# EasyEDA Pro project ProPrj_Maggy 4.1_2025-02-07.epro, board PCB1
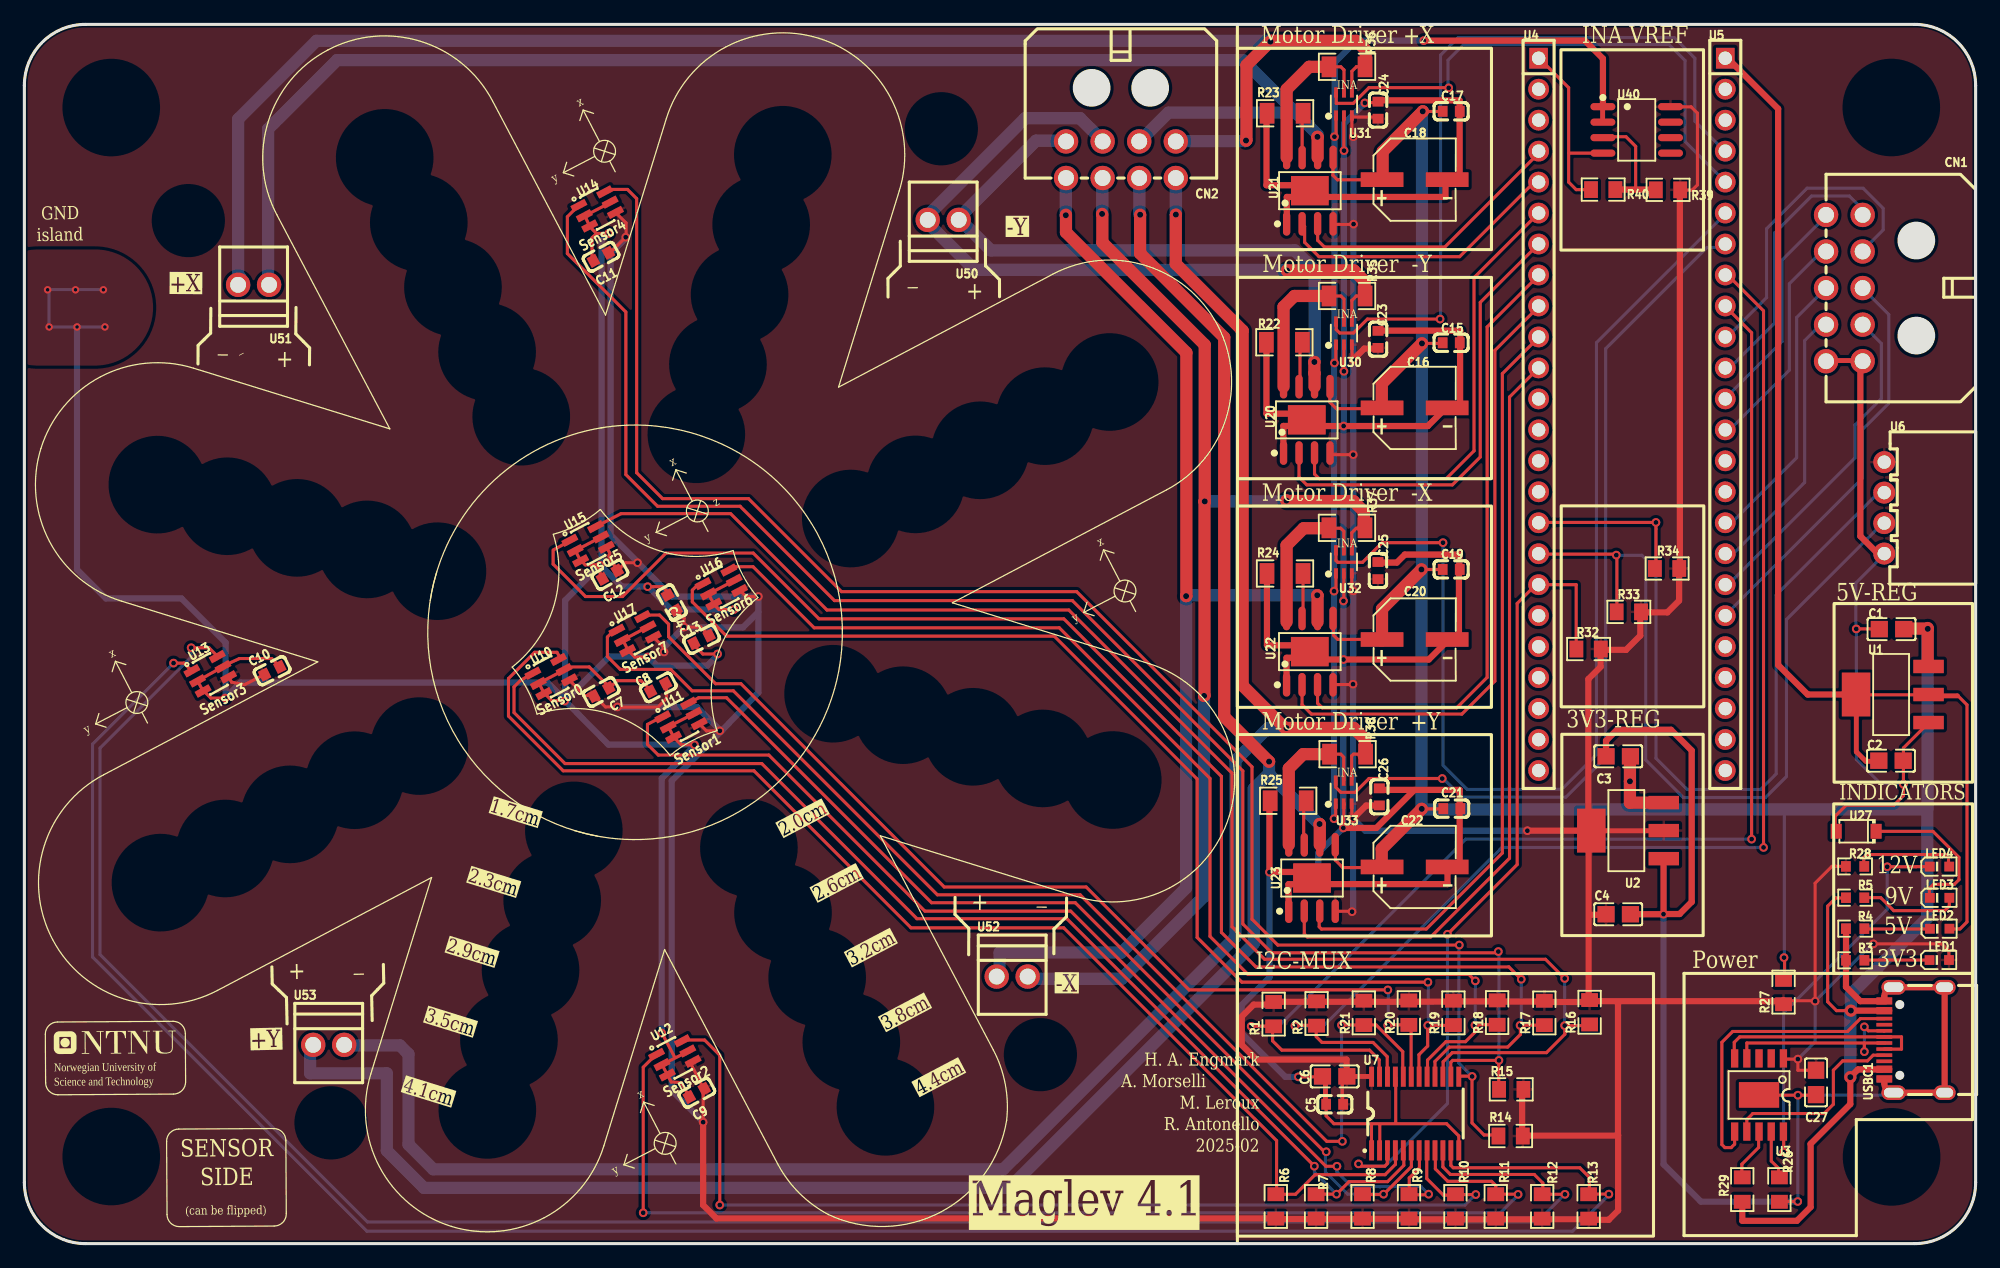
[diagram p1: board, top side]
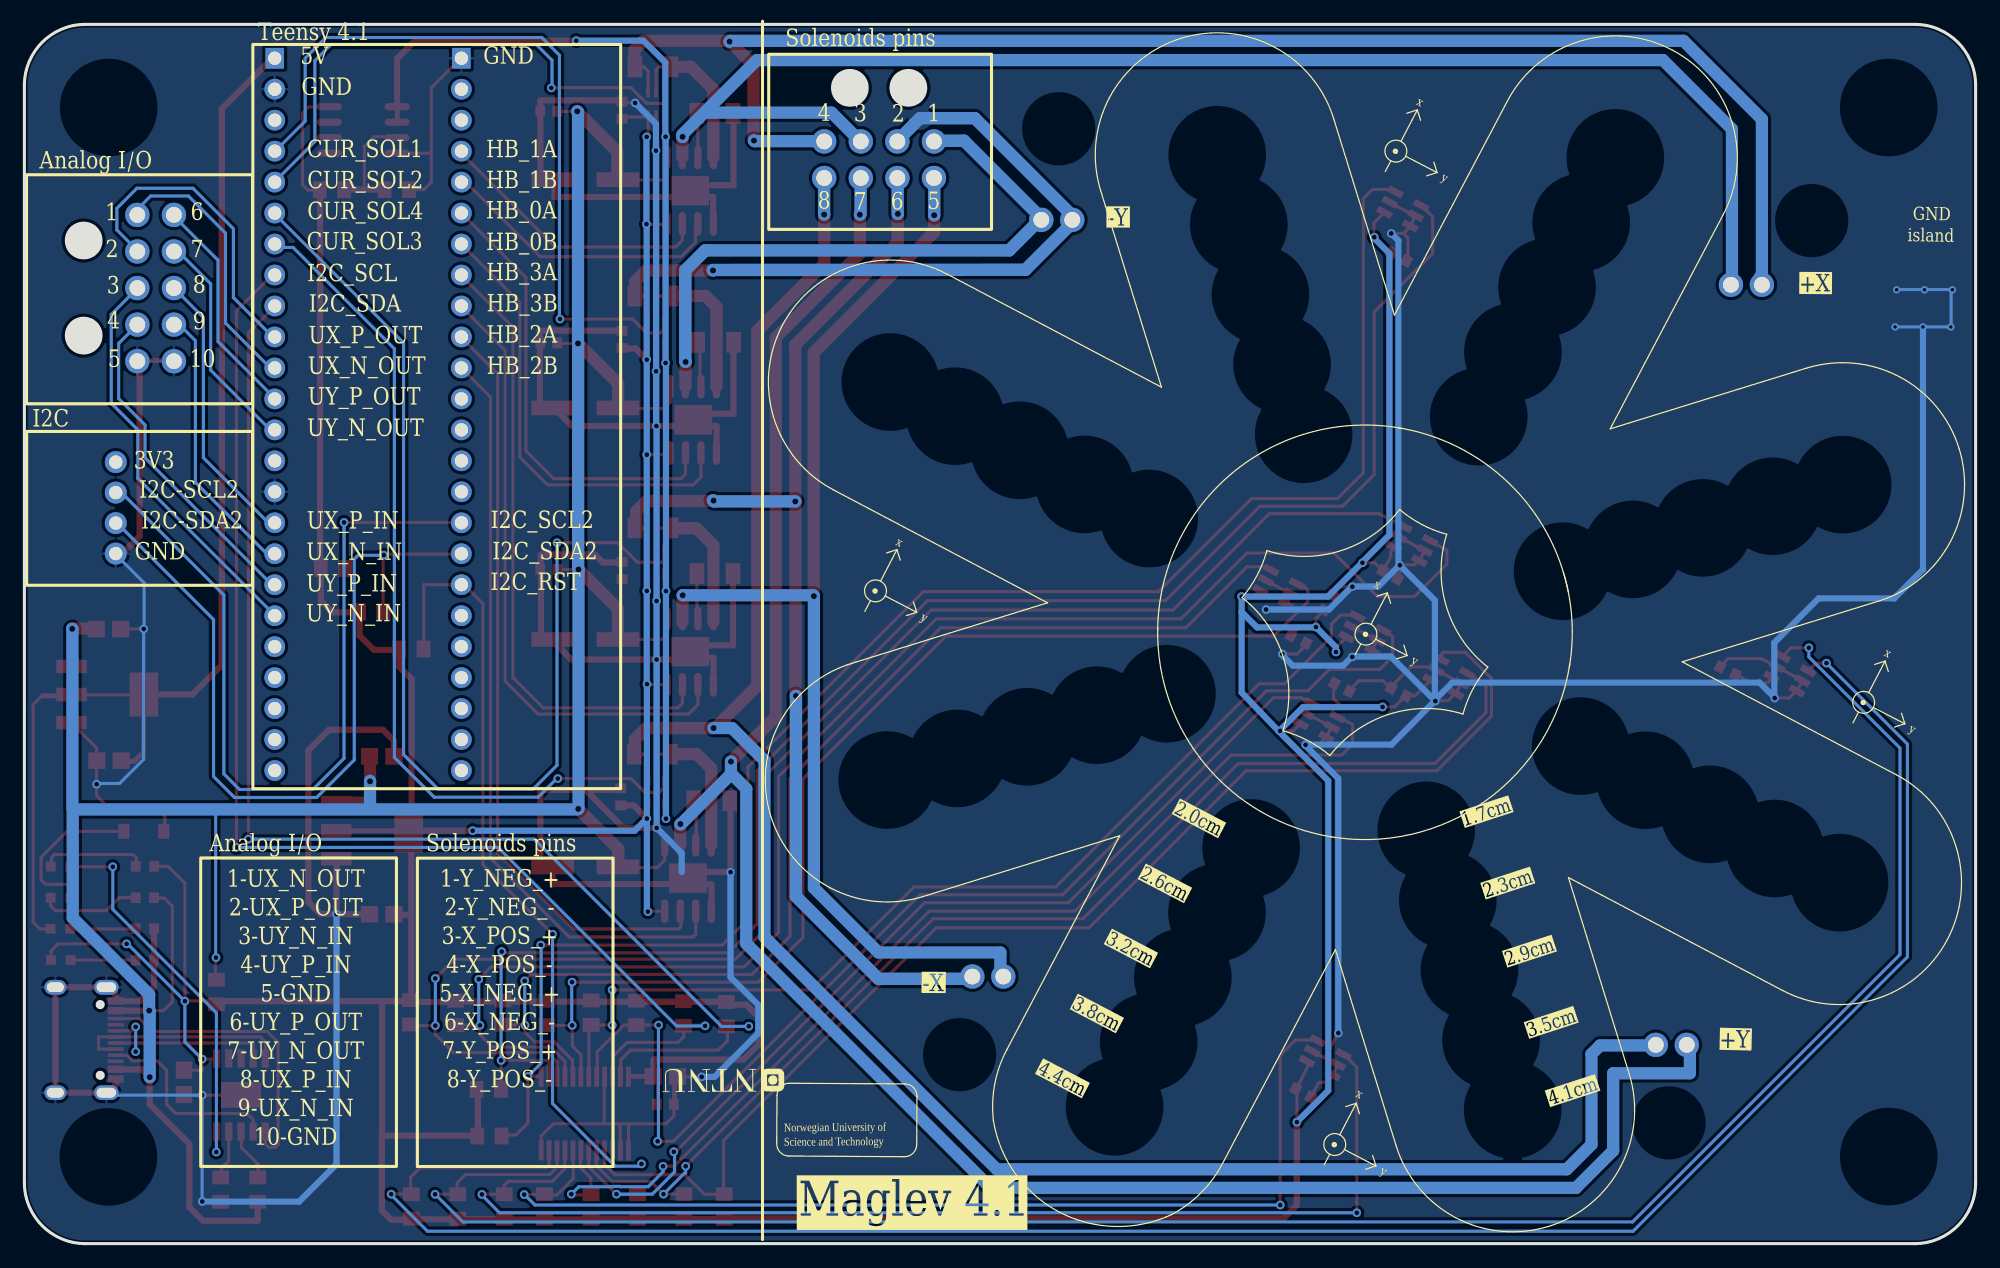
[diagram p2: board, bottom side, seen from below]

Outline 160 x 100 mm; copper layers: Top Layer, Bottom Layer. Coordinates in mm from the lower left corner of the outline.
Outline path: 0,95 0,5 arc(1.46,1.46) 5,0 155,0 arc(158.54,1.46) 160,5 160,95 arc(158.54,98.54) 155,100 5,100 arc(1.46,98.54) 0,95
Stack: Top Layer 0.035mm / Dielectric1 1.51mm FR4 er 4.5 / Bottom Layer 0.035mm

## Design rules (mm)
template: Custom Config
spacing copperThickness1oz (default): track to track 0.102, other pairs 0.152 to 0.3
spacing copperThickness2oz: track to track 0.203, other pairs 0.152 to 0.3
track width copperThickness1oz (default): min 0.127, default 0.254, max 2.54
track width copperThickness2oz: min 0.203, default 0.254, max 2.54
track width VBUS: min 0.127, default 1, max 2.54
differential pair differentialPair (default): width min 0.127, default 0.254, max 2.54; gap min 0.152, default 0.152
via viaSize (default): diameter min 0.5, default 0.61, max 10; hole min 0.3, default 0.305, max 6.3

## Placement (name value [footprint] x y rotation side)
C1  10uF  [C0805]  153.1 50.4 180 top
C2  10uF  [C0805]  153.06 39.61 0 top
C3  10uF  [C0805]  130.7 39.97 180 top
C4  10uF  [C0805]  130.7 27.01 0 top
C5  100nF  [C0603]  107.44 11.43 180 top
C6  1uF  [C0805]  107.44 13.72 0 top
C7  100nF  [C0603]  47.31 45.24 28.3 top
C8  100nF  [C0603]  51.97 45.62 207.8 top
C9  100nF  [C0603]  55.13 12.36 208.7 top
C10  100nF  [C0603]  20.32 46.99 26.6 top
C11  100nF  [C0603]  47.28 80.94 208.6 top
C12  100nF  [C0603]  48.01 54.86 209.1 top
C13  100nF  [C0603]  55.52 49.56 206.6 top
C14  100nF  [C0603]  53.09 52.58 118.9 top
C15  100nF  [C0603]  117 73.88 0 top
C16  100uF  [CAP-SMD_BD6.3-L6.6-W6.6-LS7.2-FD]  114 68.54 0 top
C17  100nF  [C0603]  117 92.87 0 top
C18  100uF  [CAP-SMD_BD6.3-L6.6-W6.6-LS7.2-FD]  114 87.27 0 top
C19  100nF  [C0603]  117 55.3 0 top
C20  100uF  [CAP-SMD_BD6.3-L6.6-W6.6-LS7.2-FD]  114 49.55 0 top
C21  100nF  [C0603]  117.05 35.67 0 top
C22  100uF  [CAP-SMD_BD6.3-L6.6-W6.6-LS7.2-FD]  114 30.9 0 top
C23  100nF  [C0603]  111 74.17 270 top
C24  100nF  [C0603]  111 92.96 270 top
C25  100nF  [C0603]  110.99 55.2 270 top
C26  100nF  [C0603]  111.1 36.64 270 top
C27  1uF  [C0805]  146.91 13.22 270 top
CN1  430451000  [CONN-TH_43045-1000]  149.24 78.37 90 top
CN2  0430450800  [CONN-TH_0430450800]  89.92 88.9 180 top
LED1  XL-1608SYGC-06  [LED0603-RD_GREEN]  157.02 23.26 0 top
LED2  XL-1608SYGC-06  [LED0603-RD_GREEN]  157.05 25.83 0 top
LED3  XL-1608SYGC-06  [LED0603-RD_GREEN]  157.04 28.36 0 top
LED4  XL-1608SYGC-06  [LED0603-RD_GREEN]  157.04 30.92 0 top
R1  1k2  [R0805]  102.44 18.82 90 top
R2  1k2  [R0805]  105.96 18.87 90 top
R3  56  [R0603]  150.13 23.24 0 top
R4  120  [R0603]  150.12 25.83 0 top
R5  200  [R0603]  150.12 28.37 180 top
R6  1k2  [R0805]  102.62 3.05 270 top
R7  1k2  [R0805]  105.92 3.05 270 top
R8  1k2  [R0805]  109.73 3.05 270 top
R9  1k2  [R0805]  113.54 3.05 270 top
R10  1k2  [R0805]  117.35 3.05 270 top
R11  1k2  [R0805]  120.65 3.05 270 top
R12  1k2  [R0805]  124.46 3.05 270 top
R13  1k2  [R0805]  128.27 3.05 270 top
R14  1k2  [R0805]  121.87 8.83 0 top
R15  1k2  [R0805]  121.92 12.65 0 top
R16  1k2  [R0805]  128.35 18.98 90 top
R17  1k2  [R0805]  124.63 18.92 90 top
R18  1k2  [R0805]  120.76 18.95 90 top
R19  1k2  [R0805]  117.18 18.92 90 top
R20  1k2  [R0805]  113.52 18.94 90 top
R21  1k2  [R0805]  109.83 18.92 90 top
R22  0.3  [R1206]  103.32 73.93 0 top
R23  0.3  [R1206]  103.38 92.71 0 top
R24  0.3  [R1206]  103.37 54.96 0 top
R25  0.3  [R1206]  103.63 36.32 0 top
R26  24k  [R0805]  143.91 4.43 270 top
R27  1k  [R0805]  144.25 20.63 90 top
R28  56  [R0603]  150.12 30.94 180 top
R29  10k  [R0805]  140.86 4.43 270 top
R32  1k2  [R0805]  128.26 48.77 180 top
R33  1k2  [R0805]  131.57 51.82 180 top
R34  1k2  [R0805]  134.7 55.37 180 top
R35  15mΩ  [R1206]  108.46 77.72 0 top
R36  15mΩ  [R1206]  108.46 96.52 0 top
R37  15mΩ  [R1206]  108.45 58.71 0 top
R38  15mΩ  [R1206]  108.5 40.14 0 top
R39  10k  [R0805]  134.78 86.43 0 top
R40  10k  [R0805]  129.46 86.45 0 top
U1  LM1117S-5.0  [SOT-223-3_L6.5-W3.4-P2.30-LS7.0-BR]  153.17 45.04 0 top
U2  LM1117S-3.3  [SOT-223-3_L6.5-W3.4-P2.30-LS7.0-BR]  131.46 33.87 0 top
U3  CH224K  [ESSOP-10_L4.9-W3.9-P1.0-LS6.0-TL-EP]  142.24 12.19 180 top
U4  X6511FV-24-C85D32  [HDR-TH_24P-P2.54-V-F]  124.17 68.01 270 top
U5  X6511FV-24-C85D32  [HDR-TH_24P-P2.54-V-F]  139.47 68.01 270 top
U6  XH-4AW米色  [CONN-TH_XH2.54-4AW]  152.51 60.35 270 top
U7  TCA9548APWR  [TSSOP-24_L7.8-W4.4-P0.65-LS6.4-BL]  114.05 10.67 0 top
U10  TLV493DA1B6HTSA2  [SOP-6_L3.0-W1.5-P0.95-LS2.5-BR]  43.2 46.51 208.1 top
U11  TLV493DA1B6HTSA2  [SOP-6_L3.0-W1.5-P0.95-LS2.5-BR]  53.85 42.93 207.8 top
U12  TLV493DA1B6HTSA2  [SOP-6_L3.0-W1.5-P0.95-LS2.5-BR]  53.34 15.24 207.8 top
U13  TLV493DA1B6HTSA2  [SOP-6_L3.0-W1.5-P0.95-LS2.5-BR]  15.24 46.74 209.1 top
U14  TLV493DA1B6HTSA2  [SOP-6_L3.0-W1.5-P0.95-LS2.5-BR#2]  46.97 84.86 207.8 top
U15  TLV493DA1B6HTSA2  [SOP-6_L3.0-W1.5-P0.95-LS2.5-BR]  46.23 57.4 207.8 top
U16  TLV493DA1B6HTSA2  [SOP-6_L3.0-W1.5-P0.95-LS2.5-BR]  57.15 53.85 207.8 top
U17  TLV493DA1B6HTSA2  [SOP-6_L3.0-W1.5-P0.95-LS2.5-BR#2]  50.08 50.03 207.8 top
U20  A4950ELJTR-T  [SOIC-8_L4.9-W3.9-P1.27-LS6.0-BL-EP]  105.16 67.56 0 top
U21  A4950ELJTR-T  [SOIC-8_L4.9-W3.9-P1.27-LS6.0-BL-EP]  105.41 86.36 0 top
U22  A4950ELJTR-T  [SOIC-8_L4.9-W3.9-P1.27-LS6.0-BL-EP]  105.4 48.55 0 top
U23  A4950ELJTR-T  [SOIC-8_L4.9-W3.9-P1.27-LS6.0-BL-EP]  105.59 29.99 0 top
U27  BZT52C6V2  [SOD-123_L2.7-W1.6-LS3.7-RD]  150.21 33.82 180 top
U30  INA214AIDCKR  [SC-70-6_L2.2-W1.3-P0.65-LS2.2-BR]  108.2 74.68 270 top
U31  INA214AIDCKR  [SC-70-6_L2.2-W1.3-P0.65-LS2.2-BR]  108.2 93.47 270 top
U32  INA214AIDCKR  [SC-70-6_L2.2-W1.3-P0.65-LS2.2-BR]  108.2 55.92 270 top
U33  INA214AIDCKR  [SC-70-6_L2.2-W1.3-P0.65-LS2.2-BR]  108.18 37.03 270 top
U40  TLV2372IDR  [SOIC-8_L4.9-W3.9-P1.27-LS6.0-BL]  132.21 91.35 270 top
U50  XY308-2.54-2P  [CONN-TH_XY308-2.54-2P]  75.34 83.97 180 top
U51  XY308-2.54-2P  [CONN-TH_XY308-2.54-2P]  18.8 78.64 180 top
U52  XY308-2.54-2P  [CONN-TH_XY308-2.54-2P]  81 21.9 0 top
U53  XY308-2.54-2P  [CONN-TH_XY308-2.54-2P]  24.95 16.3 0 top
USBC1  TYPE-C-31-M-12  [USB-C_SMD-TYPE-C-31-M-12]  154.99 16.7 90 top

## Footprints (pads in the part's own frame, mm; a bottom-side part is the same pattern mirrored in y, then rotated)
C0603
  rect 0.8x0.9 smd: 1(-0.7,0) 2(0.7,0)
C0805
  rect 1.41x1.35 smd: 1(-1,0) 2(1,0)
CAP-SMD_BD6.3-L6.6-W6.6-LS7.2-FD
  rect 3.5x1.2 smd: 1(-2.67,0) 2(2.67,0)
CONN-TH_43045-1000
  round 2 hole 1.3: 1(6.001,-1.5) 2(3.001,-1.5) 3(0.002,-1.5) 4(-2.998,-1.5) 5(-5.998,-1.5) 6(6.001,1.5) 7(3.001,1.5) 8(0.002,1.5) 9(-2.998,1.5) 10(-6.001,1.5)
CONN-TH_0430450800
  round 2 hole 1.3: 1(4.5,-1.5) 2(1.5,-1.5) 3(-1.5,-1.5) 4(-4.5,-1.5) 5(4.5,1.5) 6(1.5,1.5) 7(-1.5,1.5) 8(-4.5,1.5)
CONN-TH_XH2.54-4AW
  round 1.8 hole 1.1: 1(-3.751,0) 2(-1.248,0) 3(1.251,0) 4(3.751,0)
CONN-TH_XY308-2.54-2P
  round 2 hole 1.3: 1(-1.27,0) 2(1.27,0)
ESSOP-10_L4.9-W3.9-P1.0-LS6.0-TL-EP
  rect 0.6x1.5 smd: 1(-2,-3) 2(-1,-3) 3(0,-3) 4(1,-3) 5(2,-3) 6(2,3) 7(1,3) 8(0,3) 9(-1,3) 10(-2,3)
  rect 3.3x2.1 smd: 11(0,0)
HDR-TH_24P-P2.54-V-F
  rect 1.7x1.524 hole 1.1: 1(-29.21,0)
  round 1.7 hole 1.1: 2(-26.67,0) 3(-24.13,0) 4(-21.59,0) 5(-19.05,0) 6(-16.51,0) 7(-13.97,0) 8(-11.43,0) 9(-8.89,0) 10(-6.35,0) 11(-3.81,0) 12(-1.27,0) 13(1.27,0) 14(3.81,0) 15(6.35,0) 16(8.89,0) 17(11.43,0) 18(13.97,0) 19(16.51,0) 20(19.05,0) 21(21.59,0) 22(24.13,0) 23(26.67,0) 24(29.21,0)
LED0603-RD_GREEN
  rect 0.8x0.8 smd: 1(-0.799,-0.004) 2(0.799,0.004)
R0603
  rect 0.806x0.864 smd: 1(-0.753,0) 2(0.753,0)
R0805
  rect 1.133x1.377 smd: 1(-1,0) 2(1,0)
R1206
  rect 1.208x1.701 smd: 1(-1.479,0) 2(1.479,0)
SC-70-6_L2.2-W1.3-P0.65-LS2.2-BR
  rect 0.841x0.315 smd: 1(0.946,-0.65) 2(0.946,0) 3(0.946,0.65) 4(-0.946,0.65) 5(-0.946,0) 6(-0.946,-0.65)
SOD-123_L2.7-W1.6-LS3.7-RD
  rect 0.91x1.22 smd: 1(-1.635,0) 2(1.635,0)
SOIC-8_L4.9-W3.9-P1.27-LS6.0-BL
  oval 0.588x2.045 smd: 1(-1.905,-2.772) 2(-0.635,-2.772) 3(0.635,-2.772) 4(1.905,-2.772) 5(1.905,2.772) 6(0.635,2.772) 7(-0.635,2.772) 8(-1.905,2.772)
SOIC-8_L4.9-W3.9-P1.27-LS6.0-BL-EP
  oval 0.602x1.941 smd: 1(-1.905,-2.72) 2(-0.635,-2.72) 3(0.635,-2.72) 4(1.905,-2.72) 5(1.905,2.72) 6(0.635,2.72) 7(-0.635,2.72) 8(-1.905,2.72)
  rect 3.098x2.41 smd: 9(0,0)
SOP-6_L3.0-W1.5-P0.95-LS2.5-BR
  rect 1.3x0.55 smd: 1(1.197,-0.95) 2(1.197,0) 3(1.197,0.95) 4(-1.19,0.95) 5(-1.197,0) 6(-1.19,-0.95)
SOP-6_L3.0-W1.5-P0.95-LS2.5-BR#2
  rect 1.3x0.55 smd: 1(1.197,-0.95) 2(1.197,0) 3(1.197,0.95) 4(-1.19,0.95) 5(-1.197,0) 6(-1.19,-0.95)
SOT-223-3_L6.5-W3.4-P2.30-LS7.0-BR
  rect 2.5x1.1 smd: 1(2.97,-2.3) 2(2.97,0) 3(2.97,2.3)
  rect 2.34x3.6 smd: 4(-2.97,0)
TSSOP-24_L7.8-W4.4-P0.65-LS6.4-BL
  rect 0.4x1.65 smd: 1(-3.575,-3.022) 2(-2.925,-3.022) 3(-2.275,-3.022) 4(-1.625,-3.022) 5(-0.975,-3.022) 6(-0.325,-3.022) 7(0.325,-3.022) 8(0.975,-3.022) 9(1.625,-3.022) 10(2.275,-3.022) 11(2.925,-3.022) 12(3.575,-3.022) 13(3.575,3.022) 14(2.925,3.022) 15(2.275,3.022) 16(1.625,3.022) 17(0.975,3.022) 18(0.325,3.022) 19(-0.325,3.022) 20(-0.975,3.022) 21(-1.625,3.022) 22(-2.275,3.022) 23(-2.925,3.022) 24(-3.575,3.022)
USB-C_SMD-TYPE-C-31-M-12
  oval 1.2x2 hole 0.8x1.6: 0(-4.325,1.706) 1(4.325,1.706)
  oval 1.2x1.8 hole 0.8x1.4: 2(4.325,-2.474) 3(-4.325,-2.474)
  rect 0.3x1.3 smd: A1(-3.35,2.474) A5(-1.25,2.474) A6(-0.25,2.474) A7(0.25,2.474) A8(1.25,2.474) A12(3.35,2.474) B1(3.05,2.474) B5(1.75,2.474) B6(0.75,2.474) B7(-0.75,2.474) B8(-1.75,2.474) B12(-3.05,2.474)
  rect 0.4x1.3 smd: A4(-2.5,2.474) A9(2.5,2.474) B4(2.3,2.474) B9(-2.3,2.474)

## Nets
As in the schematic.

Pads without a net: U3 2 3; U4 2 3 12 13 14 15 19 20 21 22 23 24; U5 3 14 20 21 22 23 24; U40 5 6 7; USBC1 A8 B8

## Via types
v1: diameter 0.61, hole 0.304, Top Layer to Bottom Layer, 6 vias
v2: diameter 0.71, hole 0.4, Top Layer to Bottom Layer, 96 vias
v3: diameter 1, hole 0.5, Top Layer to Bottom Layer, 25 vias

## Routing (per net, layer and track width the routed paths; a pad name or vN(x,y) marks a point on that pad's centre or on a via; arc(x,y) is an arc through that point)
1V65: length 96.9
  Top Layer w0.254: 107.53,36.03 107.53,34.99 v2(107.39,34.85) ; v2(107.39,53.51) 107.55,53.67 U32.1 ; v2(107.42,72.23) 107.54,72.35 107.54,73.68 107.53,73.69 ; v2(107.42,90.79) 107.55,90.92 107.55,92.45
  Top Layer w0.4: 129.42,93.25 129.42,91.98
  Top Layer w0.508: v2(114.75,98.67) 127.96,98.67 129.44,97.19 129.44,93.28
  Bottom Layer w0.508: v2(107.42,90.79) v2(107.42,72.23) 107.39,72.2 v2(107.39,53.51) v2(107.39,34.85) ; v2(107.42,90.79) 107.42,91.04 ; v2(107.42,90.79) 107.44,90.79 ; v2(114.75,98.67) 109.24,98.67 107.45,96.88 107.44,90.79 107.42,90.81
3V3: length 542.9
  Top Layer w0.254: 44.67,46.23 45.96,44.94 46.67,44.94 ; v2(108.97,53.53) 108.85,53.65 U32.3 ; C10.1 18.05,45.85 16.98,46.05 U13.4 ; 124.51,19.84 124.47,19.8 ; C12.1 47.94,56.36 47.99,56.66 U15.4 ; 58.66,53.6 59.18,53.07 v2(60.19,53.07) ; v2(50.28,55.85) 49.27,55.85 48.65,55.22 ; 135.1,93.24 136.67,93.24 137.19,92.72 137.19,86.84 136.76,86.41 135.8,86.41 ; 56.18,49.83 55.45,50.57 v2(54.1,50.57) 54.1,51.28 53.34,52.03 ; 111.13,36.04 111.18,36.09 ; 47.86,81.23 48,81.23 49.34,82.57 ; 107.31,83.59 108.97,83.59 v2(108.99,83.62) ; 110.99,92.43 110.95,92.4 108.94,92.4 ; v2(108.96,34.86) 108.85,34.97 108.85,36 ; U31.3 108.85,90.9 v2(108.97,90.78) ; C27.1 145.43,14.22 v2(145.43,15.13) 144.34,15.13 144.25,15.04 ; v2(151.62,24.59) 157.23,24.59 157.81,24 157.81,23.19 ; 108.87,73.72 108.87,72.6 v2(108.97,72.5) ; 144.33,19.92 146.81,19.92 v2(146.84,19.89) 146.84,29.56 148.22,30.94 149.29,30.94 149.31,30.92 ; v2(48.63,44.02) 47.65,44.02 46.74,44.93 ; 48.44,84.61 49.34,83.71 49.34,82.6 ; v2(108.97,64.71) 107.2,64.71 U20.4 ; v2(108.95,45.89) 108.92,45.85 107.33,45.85 ; 52.44,48.51 52.44,48.89 51.58,49.75 ; 55.7,12.68 54.6,14.85 ; v2(55.66,9.96) 55.66,12.71 ; 107.43,27.24 107.45,27.26 108.84,27.26 ; 52.66,46.03 52.65,46.01 52.65,44.7 51.95,44 48.71,44 ; 55.28,42.7 55.93,42.06 v2(57.03,42.06) ; 108.07,11.38 108.07,13.35
  Top Layer w0.4: 108.46,13.71 110.44,13.71 ; 134.32,33.77 134.31,33.78 ; 134.23,33.86 129.12,33.86 129.06,33.79 ; 128.26,19.94 128.12,19.81
  Top Layer w0.508: 144.24,19.98 144.14,19.89 128.29,19.89 ; 102.61,2.06 56.75,2.06 55.66,3.16 v2(55.66,9.96) ; 113.45,2.08 113.41,2.04 109.76,2.04 ; 129.66,26.97 128.35,26.97 ; v2(108.97,72.5) 109.87,73.41 111.06,73.41 ; 109.73,19.82 109.75,19.84 113.4,19.84 117.03,19.85 ; 127.99,2 124.53,2 ; 128.23,1.95 129.92,1.95 130.69,2.72 130.69,8.86 130.68,8.86 ; 130.68,8.86 122.81,8.86 122.81,12.54 122.8,12.56 ; 130.68,8.86 130.68,19.7 130.74,19.76 ; 111.12,35.93 110.02,35.93 v2(108.96,34.86) ; 102.63,2.02 105.85,2.02 105.86,2.03 109.72,2.03 ; 132.51,51.72 132.51,49.87 131.34,48.7 129.23,48.7 ; 124.47,19.85 120.71,19.85 120.72,19.84 ; 128.61,34.43 128.24,34.8 128.24,46.3 129.25,47.31 129.25,48.36 ; 132.57,51.77 134.72,51.77 135.69,52.73 135.69,55.21 135.53,55.37 ; 128.27,19.91 128.27,33.19 128.49,33.42 ; 124.64,19.84 124.65,19.82 128.12,19.82 ; 120.96,2.02 120.94,2 113.46,2 ; 124.49,2 120.96,2 ; v2(123.25,33.87) 128.17,33.87 ; 102.48,19.6 100.8,19.6 99.83,18.63 99.83,16.3 101.03,15.1 108.41,15.1 108.41,13.95 108.07,13.61 ; 102.5,19.84 109.73,19.84 ; 109.69,2.1 109.69,2.14 ; 135.75,55.25 135.75,86.49 ; 117.09,19.87 120.62,19.87
  Bottom Layer w0.254: v2(151.62,24.59) 151.54,24.59 v2(146.84,19.89) 146.84,16.55 v2(145.43,15.13) ; 50.33,55.75 50.33,55.84
  Bottom Layer w0.508: v2(108.96,34.86) 108.96,45.88 v2(108.95,45.89) 108.97,45.9 v2(108.97,53.53) v2(108.97,64.71) v2(108.97,72.5) 108.98,72.51 108.98,83.6 v2(108.99,83.62) 108.99,90.76 v2(108.97,90.78) ; v2(108.96,34.86) 109.95,33.87 v2(123.25,33.87) ; v2(108.96,34.86) 108.96,27.42 108.85,27.32 ; 54.09,50.57 52.46,48.93 52.46,48.53 ; 49.37,82.5 48.07,81.2 48.07,58.12 50.32,55.87 50.33,55.84 53.09,53.07 v2(60.19,53.07) 60.19,51.8 ; 60.19,51.8 58.93,50.55 54.12,50.55 v2(54.1,50.57) ; 60.19,51.8 60.19,45.2 57.15,42.04 ; 57.09,42.06 55.15,44 48.59,44 ; 55.68,10 55.63,10 53.08,12.56 53.08,37.96 57.15,42.04 ; 57.15,42.04 57.17,42.06
  vias: v2(49.31,82.54) v2(52.45,48.52) v2(108.87,27.22)
+5V: length 94.8
  Top Layer w0.254: 157.85,25.81 158.72,25.81 159.29,26.38 159.29,44.19 158.51,44.97 ; 155.92,45.01 150.27,45.01 ; 151.94,39.52 152.08,39.39
  Top Layer w0.4: 156.11,44.93 158.51,44.93 ; 152.07,39.56 151,39.56 150.22,40.34 150.22,44.8 ; 139.44,97.35 139.43,97.35
  Top Layer w0.508: 139.16,97.35 139.54,97.35 143.81,93.08 143.81,47.46 146.23,45.04 150.08,45.04
GND: length 717.8
  Top Layer w0.254: C9.2 53.86,13.21 53.04,13.26 U12.3 U12.2 ; 53.22,41.57 52.78,42.45 ; v2(104.46,13.68) 106.43,13.68 106.44,13.66 ; 47.22,55.66 47.22,54.51 47.17,54.46 ; 106.74,11.44 106.74,10.47 107.38,9.83 116.62,9.83 117.62,8.83 117.62,7.96 117.68,7.89 ; 108.2,92.52 108.2,89.66 v2(108.21,89.65) ; 52.27,17.29 53.32,15.29 ; 109.9,93.59 110.95,93.59 ; 108.22,36.06 108.22,36 108.19,35.98 108.19,34.14 v2(108.15,34.09) ; 53.23,41.54 53.87,40.91 v2(54.95,40.91) ; 53.23,41.54 53.22,41.56 ; 53.23,41.54 53.25,41.51 ; 126.65,89.42 126.67,89.44 129.54,89.44 ; 51.14,48.11 50.06,48.11 49.51,48.65 ; 143.81,3.45 145.44,3.45 ; 128.63,86.39 128.68,86.44 ; 56.22,53.13 56.17,53.19 ; v2(16.47,44.75) 15.29,44.75 14.66,45.38 ; 44.33,44.54 43.24,44.54 42.6,45.18 ; 44.32,47.14 44.48,47.3 46.32,47.3 47.85,45.77 47.85,45.58 ; 46.33,83.49 45.96,84.29 ; 45.96,84.29 45.95,84.3 ; 45.96,84.29 47.96,85.34 ; 47.91,45.49 48.6,46.17 50.56,46.17 51.33,45.4 ; 152.8,56.52 152.7,56.62 152.46,56.62 152.35,56.52 ; 51.08,50.57 49.07,49.5 ; 51.08,50.57 51.06,50.6 ; 51.08,50.57 51.14,50.52 ; 49.07,49.5 49.47,48.73 ; 49.07,49.5 49.06,49.53 ; 108.19,73.69 108.2,73.69 v2(108.2,71.54) ; U15.3 45.17,56.84 ; 45.17,56.84 47.31,57.97 ; 45.17,56.84 U15.2 ; 46.91,82.86 46.26,83.51 ; 46.91,82.86 46.91,82.85 v2(47.91,82.85) ; 46.91,82.86 46.55,82.49 46.55,80.56 ; 112.45,13.63 112.45,9.89 112.42,9.86 ; U16.3 56.18,53.12 ; 156.18,42.75 154.08,40.65 154.08,39.55 ; 110.46,9.8 110.46,7.68 ; v2(51.11,53.88) 52.32,53.88 52.69,53.51 52.69,53.1 ; 49.51,48.65 49.58,48.53 ; 49.51,48.65 49.45,48.72 ; 52.33,14.7 54.39,15.75 ; 151.86,50.39 151.84,50.42 150.24,50.42 ; 42.61,45.13 42.18,45.99 ; v2(58.18,52.01) 56.96,52.01 56.44,52.53 ; 42.21,45.98 44.25,47.04 ; 47.23,55.67 45.99,55.67 45.58,56.08 ; 14.26,46.19 16.32,47.34 ; 58.13,54.35 56.17,53.31 ; 54.91,49.25 54.91,49.08 55.63,48.36 v2(56.84,48.36) ; 16.3,47.38 17.63,47.99 20.28,47.99 20.95,47.32 ; 146.79,12.2 146.76,12.17 v2(145.42,12.17) 143.34,12.17 143.33,12.16 ; USBC1.A12 152.51,19.89 ; v2(108.16,52.71) 108.2,52.75 U32.2 ; 111.14,7.62 111.14,9.77 111.15,9.78 ; 124.25,97.18 126.63,94.81 126.63,87.06 127.25,86.44 128.53,86.44 ; 14.66,45.32 U13.2 ; 148.48,33.82 148.48,35.05 149.39,35.96 153.3,35.96 154.08,36.74 154.08,39.55 154.15,39.62 ; 52.87,42.43 54.87,43.46 ; 111.28,37.22 111.21,37.14
  Top Layer w0.4: 106.74,11.43 C5.2 ; 106.67,11.49 106.69,11.51 106.69,13.13 106.67,13.15 ; 147.73,72.43 150.55,72.43
  Top Layer w0.504: 110.95,93.77 117.69,93.77 117.69,87.26 117.6,87.17 ; USBC1.A1 152.51,13.15 arc(152.74,12.6) USBC1.0 ; 105.87,85.84 116.52,85.84 116.52,87.36 ; USBC1.A12 152.51,20.26 arc(152.74,20.8) USBC1.1
  Top Layer w0.508: 113.99,37.22 117.69,37.22 117.69,35.54 117.68,30.78 117.81,30.78 ; 113.96,37.18 110.86,34.09 v2(108.15,34.09) ; 105.91,48.07 106.08,47.91 v2(108.16,47.91) 115.16,47.91 116.61,49.36 ; 117.73,73.85 117.73,68.7 ; 117.66,55.27 117.66,56.52 113.2,56.52 112.54,55.86 110.95,55.86 ; 101.85,92.71 101.85,86.81 104.91,86.81 ; 117.75,74.05 117.75,74.88 110.9,74.88 ; 117.69,35.47 117.71,35.46 ; 104.67,68.07 101.85,68.07 101.85,74.08 ; 105.05,30.47 105.04,30.48 102.1,30.48 ; 129.66,39.61 129.69,39.64 129.69,41.25 130.59,42.14 135.02,42.14 136.72,40.44 136.72,28.03 135.73,27.03 134.51,27.03 ; 152.62,19.89 150.54,19.89 149.37,21.06 149.37,23.25 149.37,25.83 R4.1 ; 102.1,30.48 102.1,36.19 102.05,36.24 ; 102.1,30.48 102.08,30.48 ; 104.93,49.08 101.89,49.08 101.89,55.09 ; 113.92,37.22 111.28,37.22 ; 103.5,45.97 103.5,48.05 104.95,48.05 ; 105.12,29.47 103.66,29.47 103.66,27.45 ; 116.58,68.55 115.08,67.06 v2(108.18,67.06) 105.74,67.06 105.69,67.01 ; v2(134.41,27.02) 134.4,27.01 C4.2 ; 103.52,83.96 103.52,85.84 104.91,85.84 ; 117.63,54.86 117.63,49.72 ; 104.67,67.06 103.24,67.06 103.24,64.86 ; 106.11,29.49 116.7,29.49 116.7,30.85 ; USBC1.0 USBC1.3 USBC1.2 USBC1.1 ; 134.47,31.53 134.41,31.46 134.41,27.07 ; 150.55,72.56 150.55,58.02 152.28,56.29
  Bottom Layer w0.254: 2.01,75.18 6.65,75.18 6.67,75.21 ; 2.01,75.18 2.01,78.21 ; 2.01,75.18 2.01,75.17 ; 157.71,20.95 157.69,20.97 ; 145.42,3.46 v2(145.42,12.17) ; 150.18,50.49 150.18,54.19 152.53,56.54 ; 1.97,78.25 6.54,78.25 ; 157.69,12.11 157.66,12.09 ; 154.14,37.7 154.09,37.74 152.19,37.74 150.22,39.71 150.22,50.38 ; 2.02,75.19 2.03,75.19 ; 145.44,12.17 153.35,12.17
  Bottom Layer w0.508: 54.97,40.93 47.89,40.93 44.34,44.52 ; 51.08,53.89 48.98,53.89 47.24,55.63 ; 44.32,44.61 42.91,46.02 17.72,46.02 16.5,44.8 16.5,49.29 12.88,52.92 6.69,52.92 4.31,55.29 4.31,75.17 ; 56.85,48.35 56.85,48.26 56,47.41 51.87,47.41 51.16,48.11 ; 47.25,55.66 44.34,52.75 44.34,44.54 47.95,48.16 51.14,48.16 ; 55.01,40.9 52.26,38.16 52.26,17.22 ; 51.08,53.95 53.02,52.01 v2(58.18,52.01) ; 47.33,55.66 47.33,82.27 v2(47.91,82.85) ; v2(104.46,13.68) 103.4,13.68 99.82,17.26 99.82,19.57 102.1,21.85 v2(102.1,30.46) ; 145.48,3.44 137.47,3.44 134.41,6.51 v2(134.41,27.02) ; v2(109.92,93.56) 108.21,91.85 v2(108.21,89.65) 108.2,89.63 v2(108.2,71.54) 108.2,67.08 v2(108.18,67.06) 108.16,67.04 v2(108.16,52.71) v2(108.16,47.91) 108.15,47.89 v2(108.15,34.09) 106.09,32.03 106.09,30.47
  vias: v1(1.91,78.23) v1(2.03,75.18) v1(4.19,78.23) v1(4.32,75.18) v1(6.48,78.23) v1(6.6,75.18) v2(44.3,44.5) v2(47.21,55.64) v2(51.11,48.12) v2(52.26,17.27) v2(145.41,3.45) v2(150.21,50.42) v2(154.08,37.68)
VBUS: length 255.6
  Top Layer w0.254: 107.35,51.25 107.35,49.9 107.69,49.56 110.82,49.56 ; 111.3,87.26 107.66,87.26 107.3,87.62 107.3,89.07 107.25,89.12 ; 107.51,32.7 107.51,31.44 108.11,30.84 110.32,30.84 110.35,30.82 ; 144.3,21.72 144.34,21.75 144.34,23.46 ; 116.41,55.26 116.38,55.29 v3(114.56,55.29) ; 116.27,92.87 116.26,92.86 114.7,92.86 ; 110.57,68.41 110.5,68.48 107.58,68.48 107.04,69.02 107.04,70.24 107.12,70.32 ; v3(114.58,35.66) 116.35,35.66 116.37,35.67 ; v3(114.6,73.83) 116.23,73.83 116.36,73.97 ; 149.29,28.35 148.54,28.35 147.87,27.68 147.87,19.84 148.6,19.11 v3(149.77,19.11)
  Top Layer w0.504: v3(149.72,13.66) 149.72,11.44 146.47,8.18 146.47,2.99 145.34,1.87 140.87,1.87 140.87,3.27 140.9,3.3
  Top Layer w0.508: 152.48,14.29 150.36,14.29 v3(149.72,13.66) ; v3(149.77,19.11) 152.5,19.11 152.51,19.12
  Top Layer w1: 111.38,87.29 111.38,89.57 114.68,92.87 ; 111.35,30.9 111.33,30.88 ; 134.12,36.16 131.66,36.16 131.66,37.89 ; 111.31,49.48 111.27,49.52 ; 111.3,68.63 111.3,70.54 v3(114.6,73.83) ; 131.66,37.96 131.66,39.9 131.7,39.95 ; v3(114.58,35.66) 111.3,32.37 111.3,31.05 ; 111.32,49.74 111.32,52.06 v3(114.56,55.29) ; 156.07,50.49 156.07,47.47 156.09,47.45 ; 154.11,50.45 155.99,50.45
  Bottom Layer w0.254: 144.32,23.46 144.32,35.43 144.38,35.49
  Bottom Layer w1: v3(156.08,50.42) 156.06,50.41 156.06,35.69 ; 114.56,55.29 114.56,35.68 ; 156.04,35.66 156.04,26.71 149.77,20.44 v3(149.77,19.11) 149.72,19.06 v3(149.72,13.66) ; 114.64,35.61 155.84,35.61 ; 131.66,37.96 131.66,35.75 ; v3(114.56,55.29) 114.59,55.32 114.59,73.82 v3(114.6,73.83) 114.6,92.8 v3(114.66,92.87)
  vias: v2(144.29,23.46) v3(131.66,37.92)
1_1: length 51.8
  Top Layer w1: v3(105.78,72.31) 105.78,71.39 105.79,71.37 U20.6
  Bottom Layer w1.016: 85.48,90.46 82.95,90.46 76.61,84.11 ; 76.69,84.02 79.24,81.47 104.17,81.47 105.81,79.83 105.81,72.39 105.79,72.37
1_21: length 60.5
  Top Layer w0.254: 108.85,75.67 108.85,77.36 109.22,77.72 R35.2
  Top Layer w1.016: 109.89,77.92 109.89,78.95 109.02,79.81 v3(103.53,79.81)
  Bottom Layer w1.016: 73.87,83.91 77.92,79.87 103.56,79.86 ; 74.09,84.34 82.06,92.31 86.56,92.31 88.48,90.38
1_22: length 13.8
  Top Layer w0.254: 106.98,77.72 107.95,77.72 108.2,77.47 108.2,75.67
  Top Layer w1: U20.8 103.25,76.83 104.14,77.72 106.98,77.72
2_1: length 119.2
  Top Layer w1: v3(106.03,90.78) 106.04,90.76 U21.6
  Bottom Layer w1: 91.5,90.45 93.81,92.76 104.23,92.76 ; 106.05,90.77 106.02,90.77 ; 106.06,90.95 99.94,97.07 25.64,97.07 19.98,91.41 19.98,78.78 20.08,78.68
2_21: length 128.1
  Top Layer w0.254: R36.2 109.22,96.52 108.85,96.15 108.85,94.46
  Top Layer w1: 102.21,98.5 102.07,98.5 100.21,96.65 100.21,90.51 v3(100.17,90.47) ; v3(102.18,98.59) 102.24,98.65 109.24,98.65 109.99,97.9 109.99,96.64
  Bottom Layer w1: 94.47,90.42 100.12,90.42 v3(100.17,90.47) ; v3(102.18,98.59) 102.11,98.65 23.95,98.65 17.53,92.23 17.53,79.43 17.68,79.27 17.68,78.81 17.53,78.65
2_22: length 13
  Top Layer w0.254: 108.2,94.46 108.2,96.27 107.95,96.52 106.98,96.52
  Top Layer w1: 106.98,96.52 105.35,96.52 103.5,94.67 U21.8
3_1: length 170.8
  Top Layer w1: U23.6 106.22,34.4 v3(106.21,34.42) ; 91.49,84.3 91.49,81.22 98.39,74.32 98.39,43.21 v3(102.06,39.53)
  Bottom Layer w1: v3(102.06,39.53) 102.06,38.51 106.2,34.37 ; 102.06,38.56 100.81,37.31 100.81,24.61 80.77,4.57 32.77,4.57 29.72,7.62 29.72,13.97 23.43,13.97 23.43,16.05 U53.1
  Bottom Layer w1.016: 91.43,84.43 91.43,87.3
  vias: v3(91.49,84.39)
3_21: length 169.7
  Top Layer w0.254: 108.83,38.02 108.83,40 108.98,40.14 109.83,40.14
  Top Layer w1: v3(103.49,42.29) 103.37,42.29 99.9,45.76 99.9,74.88 94.41,80.36 94.41,84.34
  Top Layer w1.016: 109.83,40.06 109.92,40.15 109.92,41.37 109.01,42.29 103.49,42.29
  Bottom Layer w1: 94.5,87.41 94.51,87.41 ; 94.38,87.28 94.42,87.31 ; v3(103.49,42.29) 101.98,42.29 99.31,39.62 99.31,25.15 80.26,6.1 33.53,6.1 31.5,8.13 31.5,15.55 30.79,16.26 26.27,16.26 U53.2
  Bottom Layer w1.016: 94.36,87.66 94.42,87.6 94.42,84.41
  vias: v3(94.42,84.4)
3_22: length 13.2
  Top Layer w0.254: R38.1 107.94,40.14 108.18,39.9 108.18,38.02
  Top Layer w1: U23.8 103.68,38.97 104.86,40.14 R38.1
4_1: length 94.7
  Top Layer w1: v3(95.26,53.11) 95.28,53.13 95.28,73.08 85.41,82.95 85.41,84.39 ; 106.04,50.98 106.04,53.15 v3(106.01,53.18)
  Bottom Layer w1: v3(106.01,53.18) 95.33,53.18 v3(95.26,53.11) 95.26,29.18 89.96,23.87 79.97,23.87 79.97,21.97
  Bottom Layer w1.016: v3(85.4,84.35) 85.4,87.21 85.5,87.32
4_21: length 97.4
  Top Layer w0.254: 108.85,56.62 108.85,58.31 109.21,58.67 109.78,58.67
  Top Layer w1: v3(96.73,44.92) 96.77,44.96 96.77,60.86 v3(96.79,60.88) 96.79,73.72 88.39,82.11 88.39,84.35 ; 109.78,58.67 109.84,58.73 109.84,60.05 108.98,60.91 103.53,60.91 v3(103.49,60.94)
  Bottom Layer w1.016: 103.54,60.97 103.45,60.88 v3(96.79,60.88) ; 82.19,21.72 89.97,21.72 96.73,28.48 v3(96.73,44.92) ; 88.48,87.45 88.39,87.36 88.39,84.45
  vias: v3(88.37,84.45)
4_22: length 13.5
  Top Layer w0.254: 106.97,58.67 107.94,58.67 108.2,58.42 108.2,56.62
  Top Layer w1: 103.5,50.98 103.5,57.28 104.9,58.67 106.97,58.67
CC1: length 16.1
  Top Layer w0.254: U3.7 141.24,10.18 141.73,10.67 147.57,10.67 148.34,11.43 148.34,14.22 149.1,14.99 151.13,14.99 151.6,15.45 USBC1.A5
CC2: length 24.8
  Top Layer w0.254: U3.6 140.24,8.16 139.95,7.87 139.45,7.87 139.19,8.13 139.19,16.51 140.08,17.4 149.49,17.4 150.55,18.45 USBC1.B5
CUR_SOL1: length 62.2
  Top Layer w0.254: v2(116.09,75.83) 110.13,75.83 108.99,74.69 107.85,74.69 107.57,74.97 107.57,75.59
  Bottom Layer w0.254: 139.45,89.59 136.98,92.06 136.98,97.22 135.28,98.92 117.57,98.92 116.13,97.48 116.13,75.87 v2(116.09,75.83)
CUR_SOL2: length 44.7
  Top Layer w0.254: 107.56,94.37 107.57,94.36 107.57,93.52 108.97,93.52 110.26,94.81 116.78,94.81 v2(116.79,94.79)
  Bottom Layer w0.254: v2(116.79,94.79) 116.74,94.85 116.74,97.06 118.02,98.34 123.28,98.34 123.29,98.35 134.85,98.35 136.18,97.03 136.18,90.39 139.45,87.12
CUR_SOL3: length 72.1
  Top Layer w0.254: v2(116.26,38.14) 116.26,38.15 110.26,38.15 109.12,37.01 107.95,37.01 107.54,37.43 107.54,37.96
  Bottom Layer w0.254: v2(116.26,38.14) 116.34,38.14 117.87,36.61 126.4,36.61 129.66,39.88 129.66,73.4 137.97,81.7 139.41,81.7 139.45,81.74 139.45,81.79
CUR_SOL4: length 92
  Top Layer w0.254: v2(116.33,57.49) 111.34,57.49 110.43,56.58 110.43,56.58 110.26,56.42 110.26,56.41 109.73,55.88 107.7,55.88 107.55,56.03 U32.6
  Bottom Layer w0.254: 139.49,84.59 139.49,84.47 128.91,73.89 128.91,40.11 126.06,37.27 118.29,37.27 116.33,39.23 v2(116.33,57.49)
DM: length 17.6
  Top Layer w0.254: U3.5 140.21,15.22 140.21,16.51 140.65,16.95 USBC1.A7 153.92,16.95 153.92,15.95 USBC1.B7
DP: length 17.1
  Top Layer w0.254: v2(150.88,17.78) 151.2,17.45 USBC1.B6 ; U3.4 141.24,16.45 150.87,16.45 ; 152.52,17.43 152.5,17.45 ; v2(150.88,15.75) 150.88,16.45 USBC1.A6
  Bottom Layer w0.254: v2(150.88,15.75) v2(150.88,17.78)
HB_0A: length 37.6
  Top Layer w0.254: U20.3 105.79,63.12 106.17,62.74 116.59,62.74 118.87,65.02 118.87,79.23 U4.6
HB_0B: length 37.5
  Top Layer w0.254: 104.52,64.84 104.52,62.86 105.16,62.23 117.09,62.23 119.38,64.52 119.38,77.2 U4.7
HB_1A: length 23.1
  Top Layer w0.254: U21.3 106.04,82.3 106.6,81.74 116.47,81.74 124.17,89.43 U4.4
HB_1B: length 23.8
  Top Layer w0.254: U4.5 124.12,87.02 123.76,87.02 117.69,80.95 106.16,80.95 104.98,82.12 104.98,83.43 U21.2
HB_2A: length 62.5
  Top Layer w0.254: U23.3 106.18,27.22 106.18,25.98 106.35,25.8 114.96,25.8 121.19,32.04 121.19,71.35 124.17,74.33 U4.10
HB_2B: length 62.7
  Top Layer w0.254: U23.2 104.95,25.4 105.21,25.15 115.32,25.15 121.78,31.61 121.78,69.44 U4.11
HB_3A: length 51.1
  Top Layer w0.254: 106.04,44.32 106.43,43.94 117.45,43.94 119.94,46.44 119.94,75.18 124.17,79.4 U4.8 ; 106.04,44.32 106.04,45.54
HB_3B: length 51.1
  Top Layer w0.254: U4.9 124.17,76.85 120.58,73.26 120.58,46.14 117.88,43.43 105.54,43.43 104.77,44.2 U22.2
I2C_RST: length 67.1
  Top Layer w0.254: U4.18 127.25,54.04 127.25,48.78 R32.2 ; 111.75,7.6 111.76,7.59 111.76,6.55 111.56,6.35 109.59,6.35 v2(109.4,6.54) ; v2(116.69,25.37) 122.41,31.09 122.41,52.51 124.04,54.14
  Bottom Layer w0.254: v2(116.69,25.37) 116.69,11.49 111.55,6.35 109.59,6.35 v2(109.4,6.54)
I2C_SCL: length 103.8
  Top Layer w0.254: 105.93,17.91 106.04,17.91 ; 105.93,17.91 104.12,17.91 ; 105.93,17.91 105.93,16.97 106.4,16.5 110.59,16.5 111.75,15.33 111.75,13.68 111.72,13.65 ; 105.93,17.91 105.93,17.97 ; v2(142.61,32.5) 142.61,76.51 139.75,79.37 139.75,79.66
  Bottom Layer w0.254: 104.34,17.85 106.52,17.85 121.16,32.5 v2(142.61,32.5)
  vias: v2(104.18,17.86)
I2C_SCL2: length 70.9
  Top Layer w0.254: 133.78,55.37 133.79,55.38 v2(133.79,59.15) 124.22,59.15 124.21,59.16
  Bottom Layer w0.254: 133.79,58.62 133.79,39.8 136.34,37.25 142.36,37.25 143.64,38.53 143.64,53.2 151.93,61.49 152.29,61.49 152.32,61.52 ; 133.79,58.63 v2(133.79,59.15)
I2C_SDA: length 105.6
  Top Layer w0.254: 100.65,17.84 102.23,17.84 ; 102.35,17.8 102.35,16.63 103.11,15.87 110.3,15.87 111.09,15.08 111.09,13.56 111.11,13.54 ; 139.45,76.88 141.63,74.71 v2(141.63,33.18)
  Bottom Layer w0.254: 100.68,17.78 100.71,17.82 102.83,17.82 118.19,33.18 v2(141.63,33.18)
  vias: v2(100.6,17.83)
I2C_SDA2: length 67.8
  Top Layer w0.254: 130.46,51.68 130.59,51.81 130.59,56.49 ; 124.23,56.55 130.45,56.55
  Bottom Layer w0.254: 152.43,59.2 152.43,59.13 144.49,51.19 144.49,38.31 142.77,36.59 136.03,36.59 132.95,39.67 132.95,56.14 132.63,56.45 130.58,56.45
  vias: v2(130.54,56.47)
SCL0: length 97.5
  Top Layer w0.254: 105.89,4.06 105.91,4.05 ; 105.9,3.92 106.03,4.06 v2(107.59,4.06) 108.62,5.08 111.78,5.08 113.11,6.41 113.11,7.53 ; 40.73,46.23 41.66,46.76 ; v2(105.78,6.35) 105.78,6.35 85.48,26.65 73.19,26.65 60.47,39.37 44.33,39.37 40.15,43.56 40.15,45.66 40.72,46.24
  Bottom Layer w0.254: v2(107.59,4.06) 105.86,5.79 105.78,5.79 v2(105.78,6.35)
SCL1: length 87.9
  Top Layer w0.254: 51.09,42.58 51.09,40.96 51.98,40.07 61.04,40.07 73.84,27.27 85.8,27.27 106.72,6.34 v2(107.63,6.34) ; 113.56,4.05 113.56,5.39 114.39,6.22 114.39,7.37 ; 113.6,4 115.1,4 v2(115.15,4.06) 115.15,3.96 ; 51.11,42.6 52.3,43.22
  Bottom Layer w0.254: v2(115.15,4.06) 114.54,4.67 111.74,4.67 111.71,4.69 111.19,4.69 111.17,4.67 108.85,4.67 107.63,5.89 v2(107.63,6.34)
SCL2: length 95.3
  Top Layer w0.254: 120.66,4.05 122.47,4.05 122.48,4.04 ; 120.66,4.05 120.63,4.05 ; 120.66,4.05 120.66,4.76 120.31,5.11 116.72,5.11 115.7,6.13 115.7,7.65 ; 120.66,4.05 120.66,4 ; v2(50.74,2.53) 50.74,14.47 51.65,15.37
  Bottom Layer w0.254: v2(122.48,4.04) 122.48,3.98 121.04,2.53 v2(50.74,2.53)
SCL3: length 179.4
  Top Layer w0.254: 128.54,4.06 129.92,4.06 v2(129.93,4.06) ; 128.33,4.1 128.33,5.44 127.54,6.22 117.16,6.22 116.97,6.41 116.97,7.67 ; 128.27,4.06 128.33,4.06 ; v2(12.23,47.61) 13.08,47.61 13.71,46.98 ; 128.33,4.05 R13.1
  Bottom Layer w0.254: v2(12.23,47.61) 5.59,40.97 5.59,23.51 28.08,1.02 126.95,1.02 129.93,4 v2(129.93,4.06)
SCL4: length 135.6
  Top Layer w0.254: 120.9,12.65 120.9,15.01 v2(120.91,15.03) 117.12,15.03 116.96,14.87 116.96,14.2 ; v2(120.86,23.96) 120.76,23.85 102.28,23.85 99.91,26.22 99.91,38.76 85.93,52.74 66.42,52.74 58.68,60.48 51.92,60.48 49.32,63.07 49.32,76.41 44.52,81.2 44.52,84.22 45.44,85.14
  Bottom Layer w0.254: v2(120.91,15.03) 120.91,23.91 v2(120.86,23.96)
SCL5: length 122.3
  Top Layer w0.254: 43.37,56.89 44.77,57.66 ; v2(122.65,17.9) 122.67,17.92 R17.1 ; 122.67,17.88 122.67,17.16 121.63,16.12 116.84,16.12 115.67,14.94 115.67,13.68 ; v2(122.74,21.68) 121.73,22.69 100.99,22.69 98.16,25.52 98.16,38.32 85.23,51.24 65.16,51.24 59.76,56.64 52.61,56.64 49.05,53.07 46.01,53.07 43.36,55.73 43.36,56.87
  Bottom Layer w0.254: v2(122.74,21.68) 122.74,17.99 122.7,17.94
SCL6: length 92.3
  Top Layer w0.254: R19.1 117.15,17.9 v2(115.08,17.9) ; 115.1,17.95 115.07,17.92 115.07,16.21 114.35,15.49 114.35,14.09 ; 55.3,53.91 55.09,53.91 54.77,53.6 54.77,52.63 57.58,49.83 84.44,49.83 96.16,38.11 96.16,25.11 99.83,21.44 v2(115.09,21.44)
  Bottom Layer w0.254: 115.12,17.96 115.12,21.41 v2(115.09,21.44)
SCL7: length 96.4
  Top Layer w0.254: 113.03,13.79 113.03,15.75 110.84,17.94 109.77,17.94 ; v2(108.07,8.39) 106.79,8.39 86.57,28.61 74.87,28.61 58.13,45.34 54.75,45.34 53,47.09 48.86,47.09 47.81,48.15 47.81,49.75 48.26,50.2 ; 108.04,17.93 109.76,17.93
  Bottom Layer w0.254: v2(108.07,8.39) 108.01,8.46 108.01,17.92 108.01,17.93
  vias: v2(108,17.93)
SDA0: length 102.1
  Top Layer w0.254: R6.1 104.23,4.05 105.84,5.65 111.57,5.65 112.43,6.51 112.43,7.44 112.38,7.48 ; 102.62,4.16 102.68,4.22 102.68,8.44 85.22,25.9 72.7,25.9 59.82,38.78 44.18,38.78 39.7,43.27 39.7,46.35 41.84,48.5 43.67,48.5 43.86,48.19 43.79,47.92
SDA1: length 81.4
  Top Layer w0.254: v2(106.75,7.53) 106.6,7.53 86.17,27.96 74.39,27.96 57.58,44.77 55.29,44.77 U11.6 ; 109.73,4.1 109.8,4.03 111.45,4.03 ; 109.73,4.1 109.68,4.1 109.64,4.06 ; 109.73,4.1 R8.1 ; 111.45,4.03 113.73,6.31 113.73,7.5
  Bottom Layer w0.254: v2(106.75,7.53) 106.68,7.46 106.68,5.88 108.51,4.06 v2(111.45,4.06)
SDA2: length 84.9
  Top Layer w0.254: 117.34,4.05 117.33,4.06 117.32,4.05 117.34,4.05 ; 117.34,4.05 117.37,4.02 v2(119.01,4.02) ; 54.01,16.7 55.78,16.7 57.02,15.45 v2(57.02,3.16) ; 114.96,7.47 114.99,7.44 114.99,5.34 116.36,3.97 117.3,3.97
  Bottom Layer w0.254: v2(57.02,3.16) 118.12,3.16 118.98,4.02 v2(119.01,4.02)
SDA3: length 173.6
  Top Layer w0.254: 15.83,48.17 15.83,48.18 15.14,48.87 v2(13.68,48.87) ; 116.32,7.51 116.32,6.28 116.93,5.67 123.81,5.67 124.51,4.97 124.51,4.05 ; v2(126.33,4.04) 126.32,4.05 R12.1
  Bottom Layer w0.254: v2(126.33,4.04) 126.31,4.04 124.04,1.78 28.13,1.78 6.2,23.71 6.2,40.64 13.68,48.12 v2(13.68,48.87)
SDA4: length 135.3
  Top Layer w0.254: 47.61,86.21 47.87,86.46 49.45,86.46 50.21,85.71 50.21,63.23 52.33,61.1 59.38,61.1 67,53.47 86.29,53.47 100.66,39.1 100.66,26.6 102.78,24.49 v2(117.66,24.49) ; v2(118.71,13.71) 118.73,13.72 118.73,13.73 ; 121.05,8.85 120.99,8.91 119.69,8.91 118.71,9.89 118.71,13.72 118.73,13.73 ; 118.73,13.73 117.6,13.73
  Bottom Layer w0.254: v2(117.66,24.49) 117.63,24.45 117.63,14.8 v2(118.71,13.71)
SDA5: length 121.3
  Top Layer w0.254: v2(126.3,17.88) 128.25,17.88 R16.1 ; v2(126.3,21.75) 124.73,23.32 101.69,23.32 99.02,25.99 99.02,38.59 85.64,51.97 65.81,51.97 57.91,59.87 48.92,59.87 U15.6 ; 116.34,14.1 116.34,14.91 117.09,15.66 124.81,15.66 126.32,17.17 126.32,17.86
  Bottom Layer w0.254: v2(126.3,17.88) 126.3,21.74 v2(126.3,21.75)
SDA6: length 94.7
  Top Layer w0.254: 115.07,14.15 115.06,14.17 115.06,15.05 116.57,16.56 118.17,16.56 118.96,17.36 118.96,17.92 ; v2(118.98,21.55) 118.45,22.08 100.34,22.08 97.22,25.2 97.22,38.15 84.86,50.51 64.76,50.51 59.75,55.52 58.17,55.52 57.8,55.15 ; 119.03,17.96 120.74,17.96
  Bottom Layer w0.254: 118.97,17.91 118.97,21.54 v2(118.98,21.55)
  vias: v2(118.95,17.91)
SDA7: length 82.6
  Top Layer w0.254: 113.55,17.95 113.53,17.94 111.84,17.94 ; 50.9,51.55 52.08,51.55 52.83,50.81 52.83,49.77 56.68,45.92 58.76,45.92 75.43,29.25 87.07,29.25 95.51,20.81 v2(111.8,20.81) ; 113.71,14.08 113.71,17.8
  Bottom Layer w0.254: v2(111.8,20.81) 111.84,20.77 111.84,17.95
  vias: v2(111.79,17.91)
UX_N_IN: length 23.1
  Bottom Layer w0.254: 139.4,56.22 139.76,56.22 145.98,62.44 145.98,74.06 147.09,75.17 147.44,75.17 147.75,75.47
UX_N_OUT: length 22.3
  Bottom Layer w0.254: U5.11 139.53,71.88 139.89,71.88 143.51,75.5 143.51,82.89 146.55,85.92 149.65,85.92 150.79,84.78 150.79,84.42
UX_P_IN: length 23
  Bottom Layer w0.254: 147.74,78.37 145.32,75.96 145.32,64.46 139.99,59.12 U5.16
UX_P_OUT: length 26.2
  Bottom Layer w0.254: CN1.2 150.74,81.46 152.42,83.14 152.42,84.91 150.77,86.56 146.18,86.56 142.86,83.24 142.86,77.59 139.71,74.44 139.55,74.44 U5.10
UY_N_IN: length 33.4
  Bottom Layer w0.254: 139.5,51.44 139.5,51.57 150.7,62.76 150.7,66.74 152.88,68.92 152.88,76.21 150.79,78.29 150.79,78.42
UY_N_OUT: length 18.5
  Bottom Layer w0.254: 147.74,81.37 147.38,81.37 144.73,78.72 144.73,71.64 139.83,66.74 U5.13
UY_P_IN: length 27.4
  Bottom Layer w0.254: 139.37,54.07 139.73,54.07 150.11,64.45 150.11,67.15 152.27,69.31 152.27,73.83 150.79,75.31
UY_P_OUT: length 18.5
  Bottom Layer w0.254: U5.12 139.47,69.34 144.12,73.99 144.12,80.66 147.74,84.28 147.74,84.37
$1N3748: length 3.2
  Top Layer w0.254: 104.52,70.28 104.6,70.37 104.6,73.41
$1N3820: length 5.4
  Top Layer w0.254: 156.03,25.8 150.9,25.8 R4.2 ; 156.03,25.8 156.16,25.8 156.15,25.8 156.03,25.8
$1N3821: length 5.2
  Top Layer w0.254: 156.18,23.23 156.15,23.26 150.98,23.26 150.95,23.28
$1N8157: length 3.8
  Top Layer w0.254: 143.24,9 143.24,6.77 143.84,6.18 143.84,5.47
$1N8202: length 4.5
  Top Layer w0.254: 142.18,9.17 142.21,9.14 142.21,7.89 140.83,6.51 140.83,5.28
$1N8651: length 3.7
  Top Layer w0.254: R23.2 104.78,92.63 U21.7
$1N8936: length 3.2
  Top Layer w0.254: 104.77,50.98 104.85,51.06 104.85,54.1
$1N9221: length 3.5
  Top Layer w0.254: 104.9,36.15 104.9,32.75 U23.7
$1N10392: length 32
  Top Layer w0.254: LED4.1 155.12,30.92 155.11,30.91 v2(152.75,30.91) ; 144.27,9.22 144.26,9.21 v2(144.26,7.51)
  Bottom Layer w0.254: 144.25,7.63 144.25,18.92 152.75,27.42 v2(152.75,30.91)
$1N10465: length 8.7
  Top Layer w0.254: 157.87,30.9 157.78,31 157.78,31.68 157.54,31.91 151.07,31.91 150.83,31.67 150.83,30.91
$1N10718: length 13.1
  Top Layer w0.254: 156.21,28.35 156.21,29.13 156.54,29.46 158.25,29.46 158.63,29.85 158.63,31.68 156.5,33.81 151.7,33.81
$1N10720: length 8.2
  Top Layer w0.254: LED3.2 157.84,27.68 157.47,27.31 153.29,27.31 152.22,28.37 R5.1
$1N18521: length 9.8
  Top Layer w0.254: 129.3,90.78 131.33,90.78 132.12,89.99 132.12,86.57 132.15,86.55
  Top Layer w0.508: 130.49,86.45 133.66,86.45 133.68,86.44

## Copper pours and planes (outline as drawn; the poured copper is in the pictures)
3V3 on Top Layer: -1.02,132.84 215.65,132.84 215.65,-1.27 -1.02,-1.27
GND on Top Layer: 0.55,81.54 1.11,81.52 1.74,81.47 2.37,81.37 2.99,81.24 3.6,81.06 4.19,80.85 4.78,80.6 5.34,80.32 5.89,79.99 6.42,79.64 6.92,79.25 7.39,78.83 7.84,78.38 8.26,77.91 8.65,77.4 9.01,76.88 9.33,76.33 9.61,75.77 9.86,75.18 10.08,74.58 10.25,73.97 10.39,73.35 10.48,72.73 10.54,72.09 10.55,71.54 10.55,82.01 10.54,81.46 10.48,80.83 10.39,80.2 10.25,79.58 10.08,78.97 9.86,78.37 9.61,77.79 9.33,77.22 9.01,76.68 8.65,76.15 8.26,75.65 7.84,75.17 7.39,74.72 6.92,74.3 6.42,73.92 5.89,73.56 5.34,73.24 4.78,72.95 4.19,72.7 3.6,72.49 2.99,72.32 2.37,72.18 1.74,72.09 1.11,72.03 0.55,72.01 6.35,72.01 5.8,72.03 5.16,72.09 4.54,72.18 3.92,72.32 3.31,72.49 2.71,72.7 2.12,72.95 1.56,73.24 1.01,73.56 0.49,73.92 -0.02,74.3 -0.49,74.72 -0.94,75.17 -1.36,75.65 -1.75,76.15 -2.1,76.68 -2.43,77.22 -2.71,77.79 -2.96,78.37 -3.17,78.97 -3.35,79.58 -3.48,80.2 -3.58,80.83 -3.63,81.46 -3.65,82.01 -3.65,71.54 -3.63,72.09 -3.58,72.73 -3.48,73.35 -3.35,73.97 -3.17,74.58 -2.96,75.18 -2.71,75.77 -2.43,76.33 -2.1,76.88 -1.75,77.4 -1.36,77.91 -0.94,78.38 -0.49,78.83 -0.02,79.25 0.49,79.64 1.01,79.99 1.56,80.32 2.12,80.6 2.71,80.85 3.31,81.06 3.92,81.24 4.54,81.37 5.16,81.47 5.8,81.52 6.35,81.54
GND on Bottom Layer: -1.02,132.84 216.41,132.84 216.41,-1.02 -1.02,-1.02

## Text on the board
Bottom Silkscreen Layer: Norwegian University of / Science and Technology | x | y | GND / island | 2.6cm | 3.2cm | 4.1cm | 3.5cm | 2.9cm | 2.3cm | 1.7cm | 2.0cm | 3.8cm | 4.4cm | 1 | 5 | 2 | 6 | Solenoids pins | 3 | 7 | 4 | 8 | I2C_SDA2 | I2C_SCL2 | I2C_RST | HB_2B | HB_3B | HB_2A | HB_0B | HB_3A | HB_1B | HB_1A | HB_0A | GND | 1-Y_NEG_+ / 2-Y_NEG_- / 3-X_POS_+ / 4-X_POS_- / 5-X_NEG_+ / 6-X_NEG_- / 7-Y_POS_+ / 8-Y_POS_- | UX_N_OUT | UY_N_OUT | UX_P_OUT | CUR_SOL2 | CUR_SOL4 | CUR_SOL1 | CUR_SOL3 | UY_P_OUT | I2C_SDA | UX_N_IN | UY_N_IN | UX_P_IN | I2C_SCL | UY_P_IN | 5V | Teensy 4.1 | 1-UX_N_OUT / 2-UX_P_OUT / 3-UY_N_IN / 4-UY_P_IN / 5-GND / 6-UY_P_OUT / 7-UY_N_OUT / 8-UX_P_IN / 9-UX_N_IN / 10-GND | Analog I/O | 10 | 9 | I2C-SDA2 | I2C-SCL2 | 3V3 | +Y | -Y | I2C | -X | +X | Maglev 4.1
Top Silkscreen Layer: Sensor3 | Sensor0 | Sensor5 | Sensor4 | Sensor7 | Sensor2 | Sensor1 | Sensor6 | Norwegian University of / Science and Technology | y | z | x | (can be flipped) | _ | INA | H. A. Engmark / A. Morselli / M. Leroux / R. Antonello / 2025-02 | GND / island | 2.0cm | 3.8cm | 4.4cm | 4.1cm | 3.5cm | 2.9cm | 2.3cm | 1.7cm | 2.6cm | 3.2cm | INDICATORS | +X | SENSOR / SIDE | -X | I2C-MUX | INA VREF | -Y | + | Motor Driver  -Y | Motor Driver  -X | Motor Driver +X | Motor Driver  +Y | 3V3-REG | 5V-REG | +Y | Power | 12V | 3V3 | 5V | 9V | Maglev 4.1
